# Altium project Toothbrush.PrjPcb
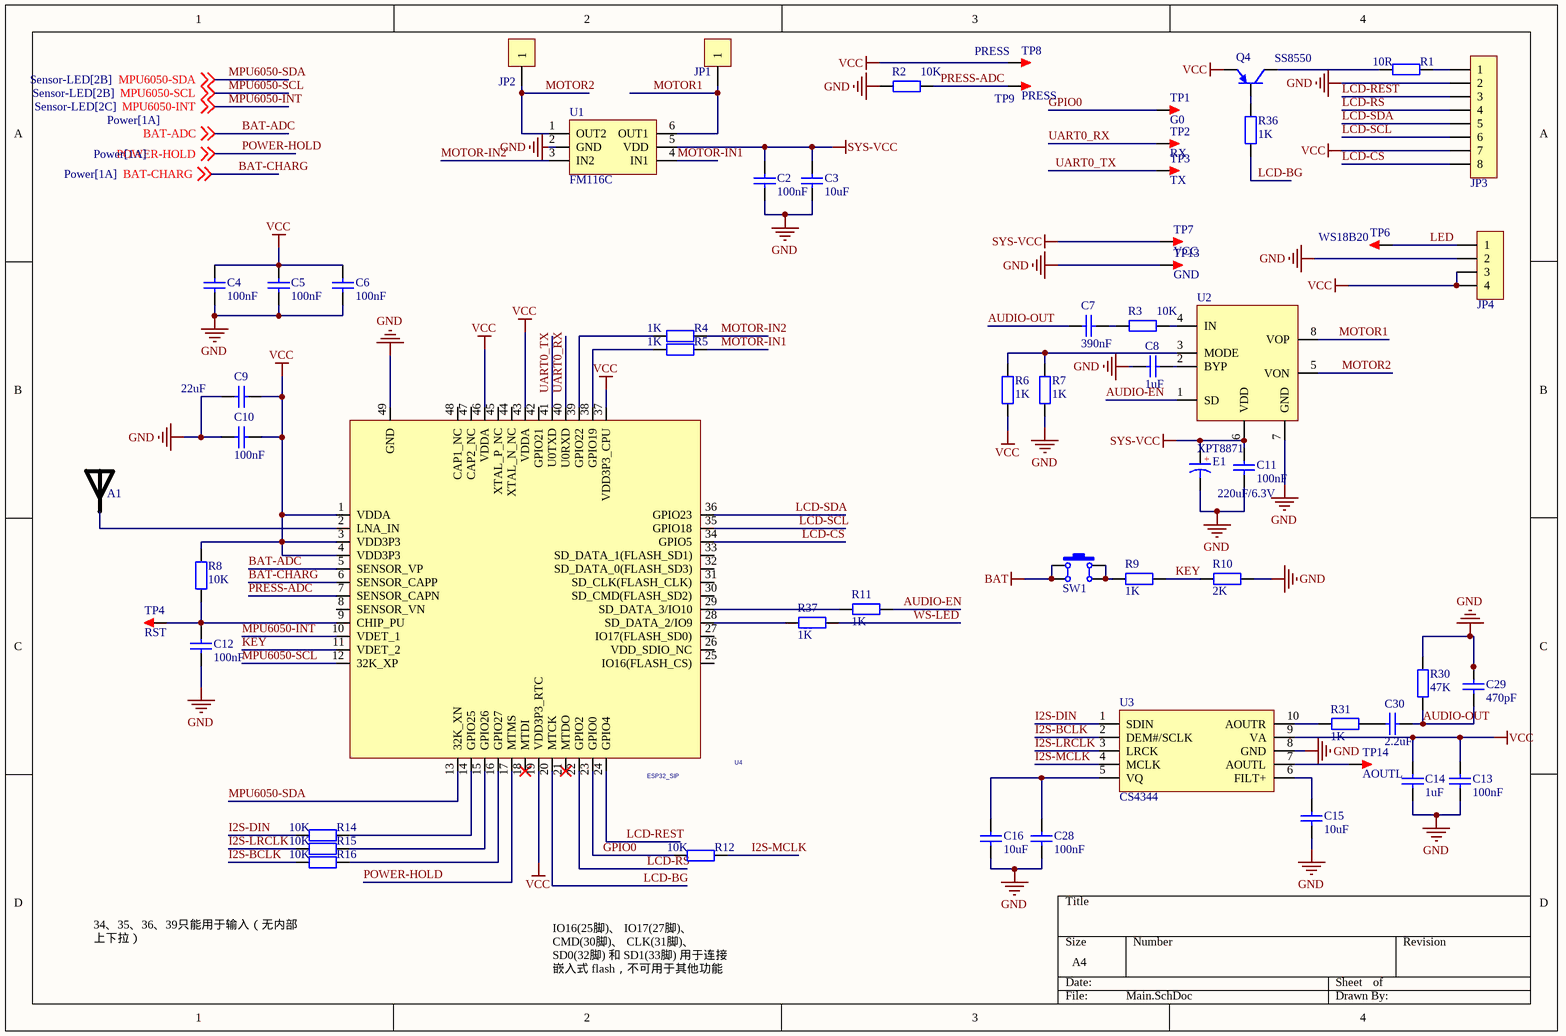
[diagram p0: Main.SchDoc]
3 sheets, 112 parts. Net scope: global (net labels, ports and power ports of the same name join across sheets).
Board file: Toothbrush.PcbDoc
Sheets:
  Main.SchDoc
  Sensor-LED.SchDoc
  Power.SchDoc

## Sheet Main.SchDoc
size A4; SheetNumber: 1; SheetTotal: 3

### Parts
A1  RAINSUN  [ANT-Rainsun-AN5120]  (value not drawn)
C2  100nF  [C0402_M]
C3  10uF  [C0402_M]
C4  100nF  [C0402_M]
C5  100nF  [C0402_M]
C6  100nF  [C0402_M]
C7  390nF  [C0402_M]
C8  1uF  [C0402_M]
C9  22uF  [C0402_M]
C10  100nF  [C0402_M]
C11  100nF  [C0402_M]
C12  100nF  [C0402_M]
C13  100nF  [C0402_M]
C14  1uF  [C0402_M]
C15  10uF  [C0402_M]
C16  10uF  [C0402_M]
C28  100nF  [C0402_M]
C29  470pF  [C0402_M]
C30  2.2uF  [C0402_M]
E1  220uF/6.3V  [C_3528]
JP1  HDR-1x1  [HDR2.54-LI-1P]  (value not drawn)
JP2  HDR-1x1  [HDR2.54-LI-1P]  (value not drawn)
JP3  CON-8P  [FPC0.5-WT-8P-H1.0]  (value not drawn)
JP4  CON-4P  [FPC0.5-WT-4P-H1.0]  (value not drawn)
Q4  SS8550  [SOT23-3N]
R1  10R  [R0402_M]
R2  10K  [R0402_M]
R3  10K  [R0402_M]
R4  1K  [R0402_M]
R5  1K  [R0402_M]
R6  1K  [R0402_M]
R7  1K  [R0402_M]
R8  10K  [R0402_M]
R9  1K  [R0402_M]
R10  2K  [R0402_M]
R11  1K  [R0402_M]
R12  10K  [R0402_M]
R14  10K  [R0402_M]
R15  10K  [R0402_M]
R16  10K  [R0402_M]
R30  47K  [R0402_M]
R31  1K  [R0402_M]
R36  1K  [R0402_M]
R37  1K  [R0402_M]
SW1  4x4x1.5  [SW SMD-4*4*1.5]  (value not drawn)
TP1  G0  [TEST 1.2]
TP2  RX  [TEST 1.2]
TP3  TX  [TEST 1.2]
TP4  RST  [TEST 1.2]
TP6  WS18B20  [TEST 1.2]
TP7  VCC  [TEST 1.2]
TP8  PRESS  [TEST 1.2]
TP9  PRESS  [TEST 1.2]
TP13  GND  [TEST 1.2]
TP14  AOUTL  [TEST 1.2]
U1  FM116C  [SOT23-6]
U2  XPT8871  [ESOP8_L]
U3  CS4344  [TSSOP-10_L3.0-W3.0-P0.50-LS4.9-BL]
U4  ESP32_SIP  [QFN48 7X7_N]

### Nets
BAT: SW1.1 SW1.4
GND: C2.2 C3.2 C4.2 C5.2 C6.2 C8.2 C9.2 C10.2 C11.2 C12.1 C13.1 C14.1 C15.2 C16.2 C28.2 C29.1 E1.2(K) JP3.2 JP4.2 R2.1 R7.2 R10.2 R30.1 TP13.1 U1.2(GND) U2.7(GND) U3.8(GND) U4.49(GND)
SYS-VCC: C2.1 C3.1 C11.1 E1.1(A) TP7.1 U1.5(VDD) U2.6(VDD)
VCC: C4.1 C5.1 C6.1 C9.1 C10.1 C13.2 C14.2 JP3.7 JP4.3 JP4.4 Q4.2(E) R6.2 R8.2 TP8.1 U3.9(VA) U4.1(VDDA) U4.3(VDD3P3) U4.4(VDD3P3) U4.19(VDD3P3_RTC) U4.37(VDD3P3_CPU) U4.43(VDDA) U4.46(VDDA)
AUDIO-EN: R11.2 U2.1(SD)
AUDIO-OUT: C7.2 C29.2 C30.2 R30.2
BAT-ADC: U4.5(SENSOR_VP) ; off-sheet BAT-ADC
BAT-CHARG: U4.6(SENSOR_CAPP) ; off-sheet BAT-CHARG
GPIO0: R12.2 TP1.1 U4.23(GPIO0)
I2S-BCLK: R16.2 U3.2(DEM#/SCLK)
I2S-DIN: R14.2 U3.1(SDIN)
I2S-LRCLK: R15.2 U3.3(LRCK)
I2S-MCLK: R12.1 U3.4(MCLK)
KEY: R9.2 R10.1 U4.11(VDET_2)
LCD-BG: R36.2 U4.20(MTCK)
LCD-CS: JP3.8 U4.34(GPIO5)
LCD-REST: JP3.3 U4.24(GPIO4)
LCD-RS: JP3.4 U4.22(GPIO2)
LCD-SCL: JP3.6 U4.35(GPIO18)
LCD-SDA: JP3.5 U4.36(GPIO23)
LED: JP4.1 TP6.1
MOTOR1: JP1.1 U1.6(OUT1) U2.8(VOP)
MOTOR2: JP2.1 U1.1(OUT2) U2.5(VON)
MOTOR-IN1: R5.1 U1.4(IN1)
MOTOR-IN2: R4.1 U1.3(IN2)
MPU6050-INT: U4.10(VDET_1) ; off-sheet MPU6050-INT
MPU6050-SCL: U4.12(32K_XP) ; off-sheet MPU6050-SCL
MPU6050-SDA: U4.13(32K_XN) ; off-sheet MPU6050-SDA
POWER-HOLD: U4.17(MTMS) ; off-sheet POWER-HOLD
PRESS-ADC: R2.2 TP9.1 U4.7(SENSOR_CAPN)
UART0_RX: TP2.1 U4.40(U0RXD)
UART0_TX: TP3.1 U4.41(U0TXD)
WS-LED: R37.2
NetA1_1: A1.1 U4.2(LNA_IN)
NetC7_1: C7.1 R3.1
NetC8_1: C8.1 U2.2(BYP)
NetC12_2: C12.2 R8.1 TP4.1 U4.9(CHIP_PU)
NetC15_1: C15.1 U3.6(FILT+)
NetC16_1: C16.1 C28.1 U3.5(VQ)
NetC30_1: C30.1 R31.2
NetJP3_1: JP3.1 R1.1
NetQ4_1: Q4.1(B) R36.1
NetQ4_3: Q4.3(C) R1.2
NetR3_2: R3.2 U2.4(IN)
NetR4_2: R4.2 U4.39(GPIO22)
NetR5_2: R5.2 U4.38(GPIO19)
NetR6_1: R6.1 R7.1 U2.3(MODE)
NetR9_1: R9.1 SW1.2 SW1.3
NetR11_1: R11.1 U4.29(SD_DATA_3/IO10)
NetR14_1: R14.1 U4.14(GPIO25)
NetR15_1: R15.1 U4.15(GPIO26)
NetR16_1: R16.1 U4.16(GPIO27)
NetR31_1: R31.1 U3.10(AOUTR)
NetR37_1: R37.1 U4.28(SD_DATA_2/IO9)
NetTP14_1: TP14.1 U3.7(AOUTL)

Not connected (* = marked no-connect by the designer): U4 8(SENSOR_VN) 18(MTDI)* 21(MTDO)* 25(IO16(FLASH_CS)) 26(VDD_SDIO_NC) 27(IO17(FLASH_SD0)) 30(SD_CMD(FLASH_SD2)) 31(SD_CLK(FLASH_CLK)) 32(SD_DATA_0(FLASH_SD3)) 33(SD_DATA_1(FLASH_SD1)) 42(GPIO21) 44(XTAL_N_NC) 45(XTAL_P_NC) 47(CAP2_NC) 48(CAP1_NC)

### Notes on the sheet
- 34、35、36、39只能用于输入（无内部上下拉）
- IO16(25脚)、 IO17(27脚)、 CMD(30脚)、 CLK(31脚)、 SD0(32脚) 和 SD1(33脚) 用于连接嵌入式 flash，不可用于其他功能
- (in symbol CT) +

### Library data of the parts
A1 = ANT-Rainsun-AP5120
C2-C16 C28-C30 = C: 贴片电容/MLCC电容; BOM名称: 无极性贴片电容; 联系下单店铺卖家 免费帮你查找封装: 联系下单店铺卖家 免费技术支持
E1 = CT: 贴片钽电容; 联系下单店铺卖家 免费帮你查找封装: 联系下单店铺卖家 免费技术支持; BOM名称: 贴片钽电容
JP1 JP2 = Header 1: 1P接插件; BOM名称: 2P接插件; 联系卖家，免费查找封装: 唯一出售店铺网址https://shop463601444.taobao.com; 封装库来自淘宝卖家ID：黄晶宝石: 其他店铺购入均为盗版封装库，请立即申请退款，本店现金奖励50~200元
JP3 = Header 8: 8P连接器; 封装库来自淘宝卖家ID：黄晶宝石: 唯一出售店铺网址https://shop463601444.taobao.com; 联系卖家 免费查找封装: 封装库来自淘宝卖家ID：黄晶宝石; BOM名称: 8P连接器; 联系卖家 免费技术支持: 封装库来自淘宝卖家ID：黄晶宝石
JP4 = Header 4: 4P连接器; 封装库来自淘宝卖家ID：黄晶宝石: 唯一出售店铺网址https://shop463601444.taobao.com; 联系卖家 免费查找封装: 封装库来自淘宝卖家ID：黄晶宝石; BOM名称: 4P连接器; 联系卖家 免费技术支持: 封装库来自淘宝卖家ID：黄晶宝石
Q4 = 8550-SMD: 高频放大-PNP型; 参数: 40V 1.5A 1W 100MHZ; 8元以下特价购入的买家: 还可以联系卖家远程指导AD软件使用; BOM名称: 高频放大-PNP型
R1-R12 R14-R16 R30 R31 R36 R37 = R: 贴片电阻; 联系下单店铺卖家 免费帮你查找封装: 联系下单店铺卖家 免费技术支持; BOM名称: 贴片电阻
SW1 = SW SMD-4x4: 贴片4x4轻触开关; 联系卖家，免费查找封装: 唯一出售店铺网址https://shop463601444.taobao.com; 封装库来自淘宝卖家：黄晶宝石: 其他店铺购入均为盗版封装库，请立即申请退款，本店现金奖励200~1000元; BOM名称: 贴片4x4轻触开关
TP1-TP4 TP6-TP9 TP13 TP14 = TEST: 测试点; 联系卖家，免费查找封装: 唯一出售店铺网址https://shop463601444.taobao.com; 封装库来自淘宝卖家：黄晶宝石: 其他店铺购入均为盗版封装库，请立即申请退款，本店现金奖励200~1000元; BOM名称: 测试点
U1 = FM116C: 电机驱动芯片
U2 = XPT8871: A/B/D类功放
U3 = CS4344: 10-Pin, 24-Bit, 192 kHz Stereo D/A Converter
U4 = ESP32-PICO: ESP32 PICO

## Sheet Sensor-LED.SchDoc
size A4; SheetNumber: 2; SheetTotal: 3
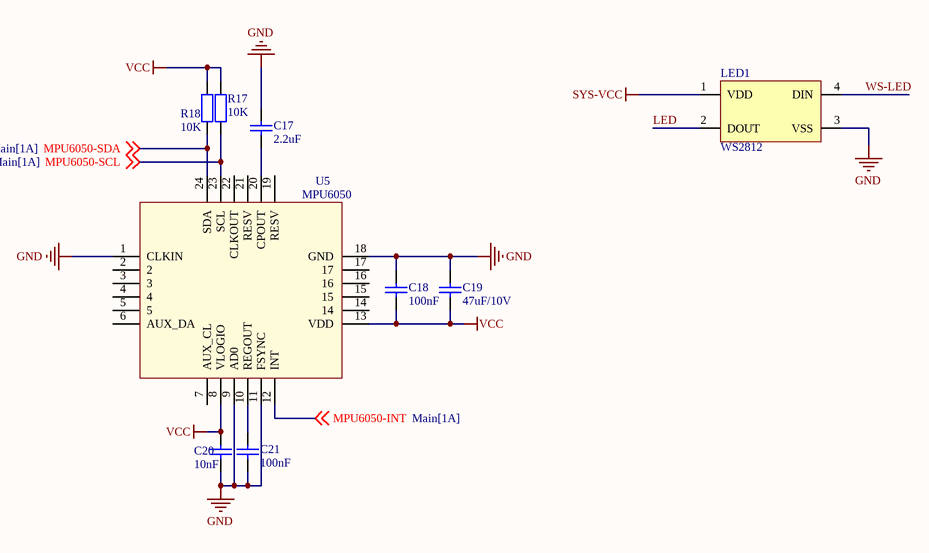
[diagram p1: Sensor-LED.SchDoc]

### Parts
C17  2.2uF  [C0402_M]
C18  100nF  [C0402_M]
C19  47uF/10V  [C0402_M]
C20  10nF  [C0402_M]
C21  100nF  [C0402_M]
LED1  WS2812  [LED 3535]
R17  10K  [R0402_M]
R18  10K  [R0402_M]
U5  MPU6050  [QFN24 4x4_M]

### Nets
GND: C17.2 C18.2 C19.2 C20.1 C21.1 LED1.3(VSS) U5.1(CLKIN) U5.9(AD0) U5.11(FSYNC) U5.18(GND)
SYS-VCC: LED1.1(VDD)
VCC: C18.1 C19.1 C20.2 R17.1 R18.1 U5.8(VLOGIO) U5.13(VDD)
LED: LED1.2(DOUT)
MPU6050-INT: U5.12(INT) ; off-sheet MPU6050-INT
MPU6050-SCL: R17.2 U5.23(SCL) ; off-sheet MPU6050-SCL
MPU6050-SDA: R18.2 U5.24(SDA) ; off-sheet MPU6050-SDA
WS-LED: LED1.4(DIN)
NetC17_1: C17.1 U5.20(CPOUT)
NetC21_2: C21.2 U5.10(REGOUT)

Not connected (* = marked no-connect by the designer): U5 2 3 4 5 6(AUX_DA) 7(AUX_CL) 14 15 16 17 19(RESV) 21(RESV) 22(CLKOUT)

### Library data of the parts
C17-C21 = C: as C2 on sheet Main
R17 R18 = R: 贴片电阻; 联系下单店铺卖家 免费帮你查找封装: 联系下单店铺卖家 免费技术支持; BOM名称: 贴片电阻
U5 = MPU6050: 三轴加速度+三轴陀螺仪; 联系卖家 免费查找封装: 唯一出售店铺网址https://shop463601444.taobao.com; 封装库来自淘宝卖家：黄晶宝石: 其他店铺购入均为盗版封装库，请立即申请退款，本店现金奖励100~500元

## Sheet Power.SchDoc
size A4; SheetNumber: 3; SheetTotal: 3
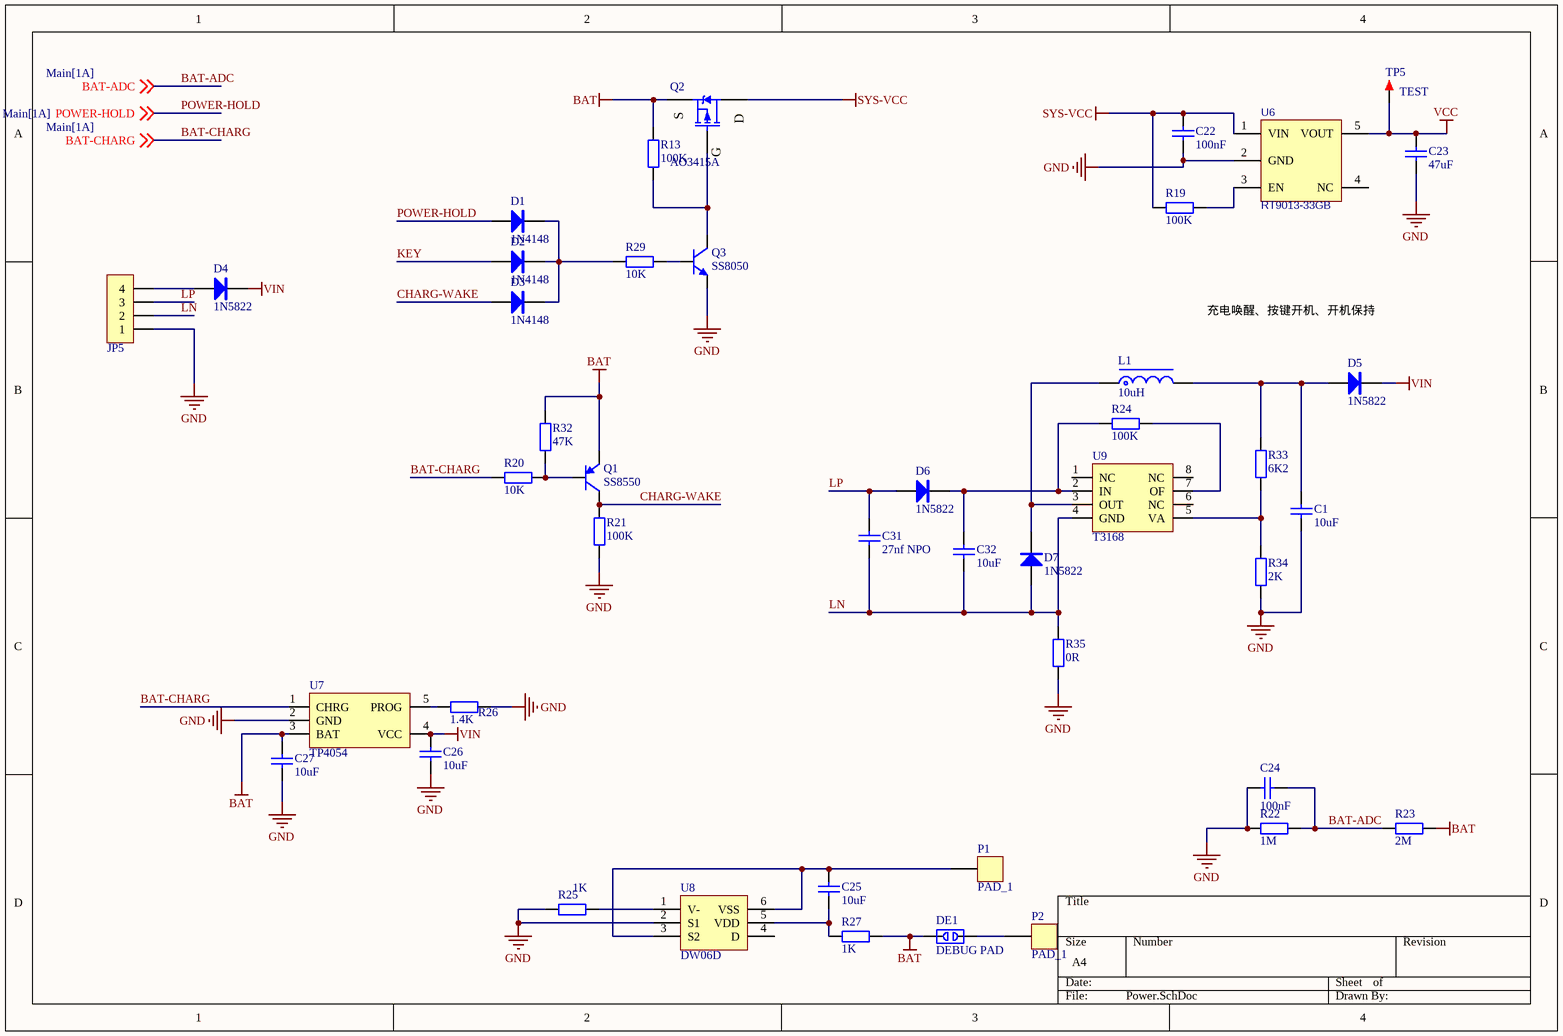
[diagram p2: Power.SchDoc]

### Parts
C1  10uF  [C1206_M]
C22  100nF  [C0402_M]
C23  47uF  [C0603_L]
C24  100nF  [C0402_M]
C25  10uF  [C0402_M]
C26  10uF  [C0402_M]
C27  10uF  [C0402_M]
C31  27nf NPO  [C1206_M]
C32  10uF  [C1206_M]
D1  1N4148  [SOD-323]
D2  1N4148  [SOD-323]
D3  1N4148  [SOD-323]
D4  1N5822  [SOD-123]
D5  1N5822  [SOD-123]
D6  1N5822  [SOD-123]
D7  1N5822  [SOD-123]
DE1  DEBUG PAD  [DEBUG_A]
JP5  HDR-1X4  [HDR2.54-LI-4P]  (value not drawn)
L1  10uH  [SWPA3012]
P1  PAD_1  [PAD-3.2X1.7]
P2  PAD_1  [PAD-3.2X1.7]
Q1  SS8550  [SOT23-3N]
Q2  AO3415A  [SOT23-3N]
Q3  SS8050  [SOT23-3N]
R13  100K  [R0402_M]
R19  100K  [R0402_M]
R20  10K  [R0402_M]
R21  100K  [R0402_M]
R22  1M  [R0402_M]
R23  2M  [R0402_M]
R24  100K  [R0402_M]
R25  1K  [R0402_M]
R26  1.4K  [R0402_M]
R27  1K  [R0402_M]
R29  10K  [R0402_M]
R32  47K  [R0402_M]
R33  6K2  [R0402_M]
R34  2K  [R0402_M]
R35  0R  [R0805_M]
TP5  TEST  [TEST 1.2]
U6  RT9013-33GB  [SOT-23-5]
U7  TP4054  [SOT23-5]
U8  DW06D  [SOT23-6L]
U9  T3168  [SOP8]

### Nets
BAT: C27.1 DE1.1 Q1.2(E) Q2.2(S) R13.2 R23.2 R27.2 R32.2 U7.3(BAT)
GND: C1.1 C22.1 C23.1 C24.2 C26.2 C27.2 JP5.1 Q3.2(E) R21.1 R22.1 R25.1 R26.2 R34.1 R35.2 U6.2(GND) U7.2(GND) U8.2(S1)
SYS-VCC: C22.2 Q2.3(D) R19.1 U6.1(VIN)
VCC: C23.2 TP5.1 U6.5(VOUT)
VIN: C26.1 D4.2(K) D5.2(K) U7.4(VCC)
BAT-ADC: C24.1 R22.2 R23.1 ; off-sheet BAT-ADC
BAT-CHARG: R20.2 U7.1(CHRG) ; off-sheet BAT-CHARG
CHARG-WAKE: D3.1(A) Q1.3(C) R21.2
KEY: D2.1(A)
LN: C31.1 C32.1 D7.1(A) JP5.2 R35.1 U9.4(GND)
LP: C31.2 D6.1(A) JP5.3
POWER-HOLD: D1.1(A) ; off-sheet POWER-HOLD
NetC1_2: C1.2 D5.1(A) L1.2 R33.2
NetC25_1: C25.1 P1.1 U8.3(S2) U8.6(VSS)
NetC25_2: C25.2 R27.1 U8.5(VDD)
NetC32_2: C32.2 D6.2(K) R24.1 U9.2(IN)
NetD1_2: D1.2(K) D2.2(K) D3.2(K) R29.2
NetD4_1: D4.1(A) JP5.4
NetD7_2: D7.2(K) L1.1 U9.3(OUT)
NetDE1_2: DE1.2 P2.1
NetQ1_1: Q1.1(B) R20.1 R32.1
NetQ2_1: Q2.1(G) Q3.3(C) R13.1
NetQ3_1: Q3.1(B) R29.1
NetR19_2: R19.2 U6.3(EN)
NetR24_2: R24.2 U9.7(OF)
NetR25_2: R25.2 U8.1(V-)
NetR26_1: R26.1 U7.5(PROG)
NetR33_1: R33.1 R34.2 U9.5(VA)

Not connected (* = marked no-connect by the designer): U6 4(NC); U8 4(D); U9 1(NC) 6(NC) 8(NC)

### Notes on the sheet
- 充电唤醒、按键开机、开机保持

### Library data of the parts
C1 C22-C27 C31 C32 = C: as C2 on sheet Main
D1-D3 = 1N4148: 开关二极管; BOM名称: 高速开关二极管; 以赠品形式获赠本封装库的买家，还可联系卖家免费指导AD软件使用: 封装库来自淘宝卖家ID：黄晶宝石
D4-D7 = 1N5822: 肖特基二极管; 以赠品形式获赠本封装库的买家，还可联系卖家免费指导AD软件使用: 封装库来自淘宝卖家ID：黄晶宝石; BOM名称: 肖特基二极管
DE1 = DEBUG: 调试断点焊盘; 联系卖家，免费查找封装: 唯一出售店铺网址https://shop463601444.taobao.com; 封装库来自淘宝卖家：黄晶宝石: 其他店铺购入均为盗版封装库，请立即申请退款，本店现金奖励200~1000元; BOM名称: 调试断点焊盘
JP5 = Header 4: 4P接插件; 联系卖家，免费查找封装: 唯一出售店铺网址https://shop463601444.taobao.com; 封装库来自淘宝卖家ID：黄晶宝石: 其他店铺购入均为盗版封装库，请立即申请退款，本店现金奖励50~200元; BOM名称: 4P接插件
L1 = L-SWPA: 顺络_SWPA贴片屏蔽电感; BOM名称: 功率屏蔽电感; 联系下单店铺卖家 免费帮你查找封装: 联系下单店铺卖家 免费技术支持
P1 P2 = PAD_1: 焊盘
Q1 = 8550-SMD: as Q4 on sheet Main; BOM名称: 高频放大-PNP型
Q2 = AO3415A: P沟道 20V/4A; BOM名称: 场效应管; 参数: P沟道 30V/4.2A; 8元以下特价购入的买家: 还可以联系卖家远程指导AD软件使用
Q3 = 8050-SMD: 高频放大-NPN型; 参数: 40V 1.5A 1W 100MHZ; 8元以下特价购入的买家: 还可以联系卖家远程指导AD软件使用; BOM名称: 高频放大-NPN型
R13 R19-R27 R29 R32-R35 = R: 贴片电阻; 联系下单店铺卖家 免费帮你查找封装: 联系下单店铺卖家 免费技术支持; BOM名称: 贴片电阻
TP5 = TEST: as TP1 on sheet Main; BOM名称: 测试点
U6 = RT9013-33GB: LDO 3.3V/0.5A; BOM名称: RT9193-30GB; 芯片厂商: RICHTEK; 封装库来自淘宝卖家：黄晶宝石: 其他店铺购入的买家，请立即申请退款，本店现金奖励200~1000元
U7 = TP4054: 锂电池充电芯片
U8 = DW06D: 二合一锂电池保护IC
U9 = T3168: T3168无线充芯片

## Nets that join several sheets
BAT: Main (SW1.1 SW1.4), Power (9 pins)
GND: Main (28 pins), Sensor-LED (10 pins), Power (17 pins)
SYS-VCC: Main (7 pins), Sensor-LED (LED1.1), Power (C22.2 Q2.3 R19.1 U6.1)
VCC: Main (22 pins), Sensor-LED (7 pins), Power (C23.2 TP5.1 U6.5)
BAT-ADC: Main (U4.5), Power (C24.1 R22.2 R23.1)
BAT-CHARG: Main (U4.6), Power (R20.2 U7.1)
KEY: Main (R9.2 R10.1 U4.11), Power (D2.1)
LED: Main (JP4.1 TP6.1), Sensor-LED (LED1.2)
MPU6050-INT: Main (U4.10), Sensor-LED (U5.12)
MPU6050-SCL: Main (U4.12), Sensor-LED (R17.2 U5.23)
MPU6050-SDA: Main (U4.13), Sensor-LED (R18.2 U5.24)
POWER-HOLD: Main (U4.17), Power (D1.1)
WS-LED: Main (R37.2), Sensor-LED (LED1.4)